# Altium schematic sheet Main PCB.SchDoc
size A4; SheetNumber: 1; SheetTotal: 7; SPICEModelCacheBXTNJVLD: <root> / <DocumentId>BXTNJVLD</DocumentId> / </root>
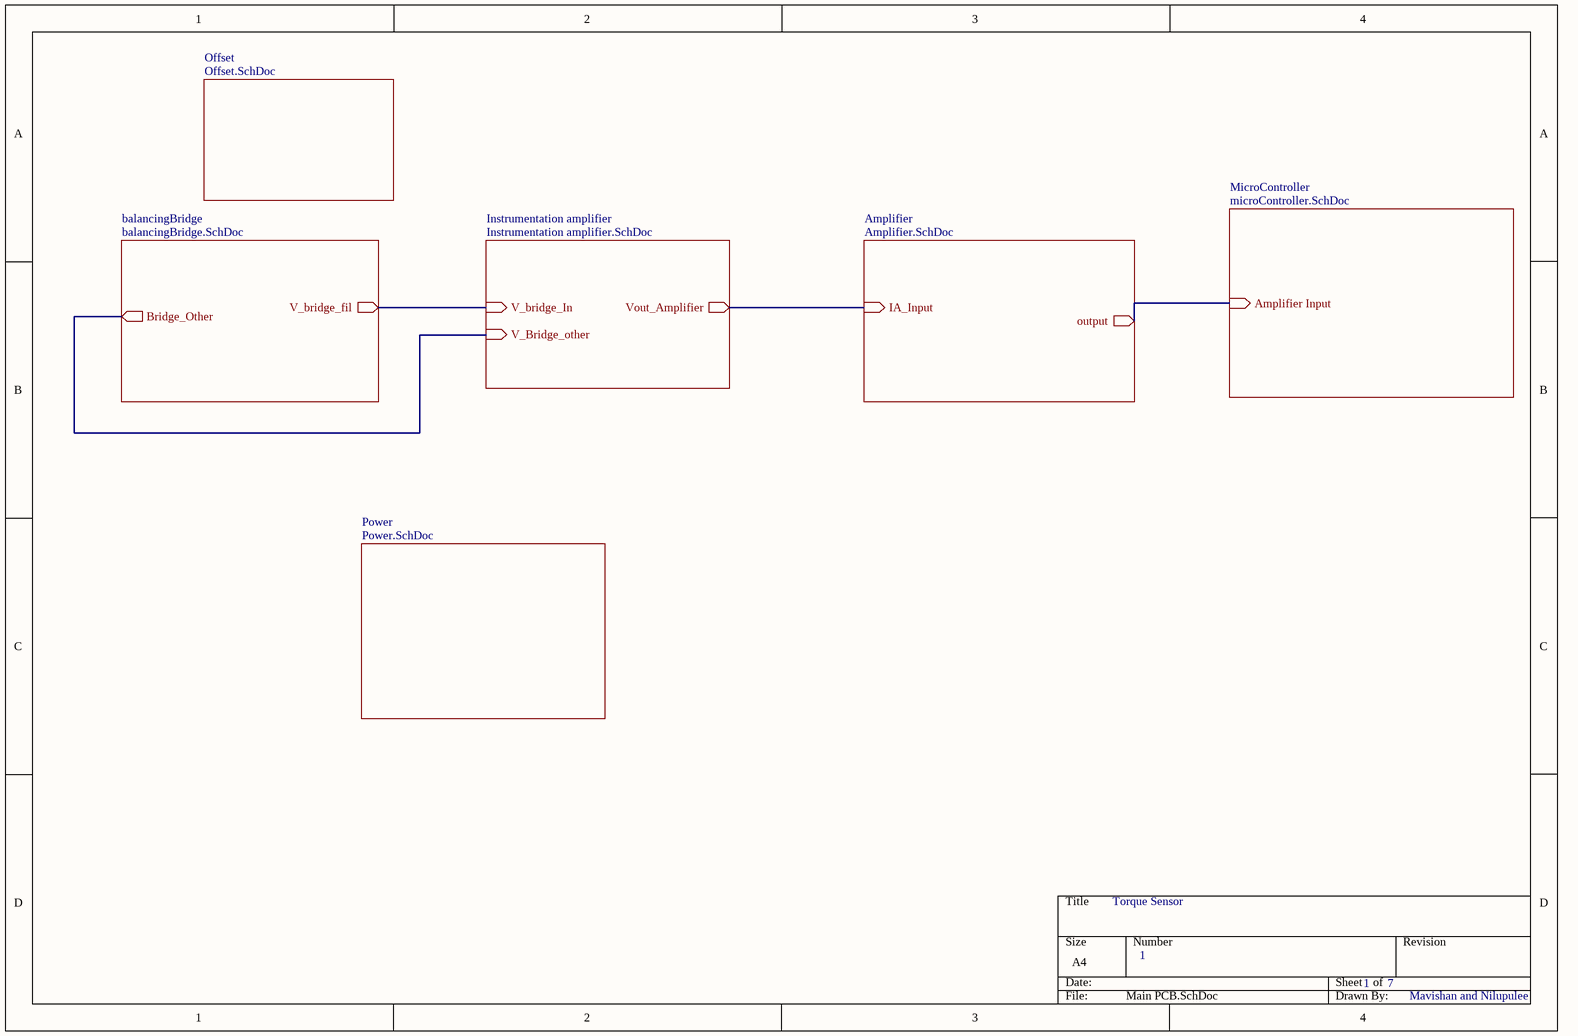
[diagram p0: Main PCB.SchDoc]

## Sub-sheets
Amplifier = Amplifier.SchDoc: IA_Input (in), output (out)
balancingBridge = balancingBridge.SchDoc: V_bridge_fil (out), Bridge_Other (out)
Instrumentation amplifier = Instrumentation amplifier.SchDoc: V_bridge_In (in), Vout_Amplifier (out), V_Bridge_other (in)
MicroController = microController.SchDoc: Amplifier Input (in)
Offset = Offset.SchDoc: no entries
Power = Power.SchDoc: no entries

## Nets
(unnamed): sheet balancingBridge/V_bridge_fil, sheet Instrumentation amplifier/V_bridge_In
(unnamed): sheet balancingBridge/Bridge_Other, sheet Instrumentation amplifier/V_Bridge_other
(unnamed): sheet Instrumentation amplifier/Vout_Amplifier, sheet Amplifier/IA_Input
(unnamed): sheet Amplifier/output, sheet MicroController/Amplifier Input

## Notes on the sheet
- Torque Sensor
- 1
- 7
- Mavishan and Nilupulee